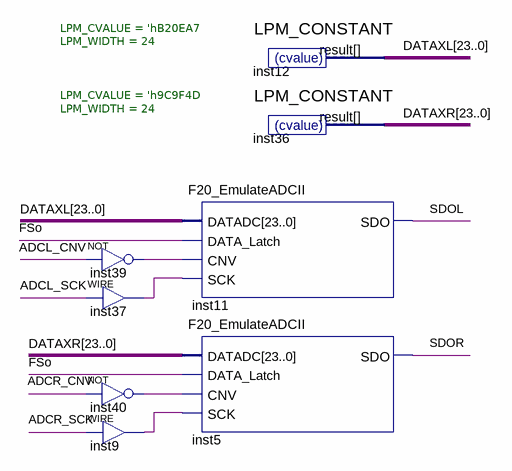
[diagram p0: schematic sheet]
// Quartus schematic Emulate_ADC.bdf as structural Verilog: 8 symbols, 0 pins
module Emulate_ADC (
);

  wire ADCL_CNV, ADCL_SCK, ADCR_CNV, ADCR_SCK, FSo, inst9_out, inst37_out, inst39_out, inst40_out, SDOL, SDOR;
  wire [23:0] DATAXL, DATAXR;

  not inst39 (inst39_out, ADCL_CNV);
  assign inst37_out = ADCL_SCK;  // WIRE inst37
  not inst40 (inst40_out, ADCR_CNV);
  assign inst9_out = ADCR_SCK;  // WIRE inst9
  F20_EmulateADCII inst11 (.DATADC(DATAXL), .DATA_Latch(FSo), .CNV(inst39_out), .SCK(inst37_out), .SDO(SDOL));
  F20_EmulateADCII inst5 (.DATADC(DATAXR), .DATA_Latch(FSo), .CNV(inst40_out), .SCK(inst9_out), .SDO(SDOR));
  LPM_CONSTANT #(.LPM_CVALUE('hB20EA7), .LPM_WIDTH(24)) inst12 (.result(DATAXL));
  LPM_CONSTANT #(.LPM_CVALUE('h9C9F4D), .LPM_WIDTH(24)) inst36 (.result(DATAXR));
endmodule
